# EAGLE design Motor_beaglebone_3ch (EAGLE 7.2.0)
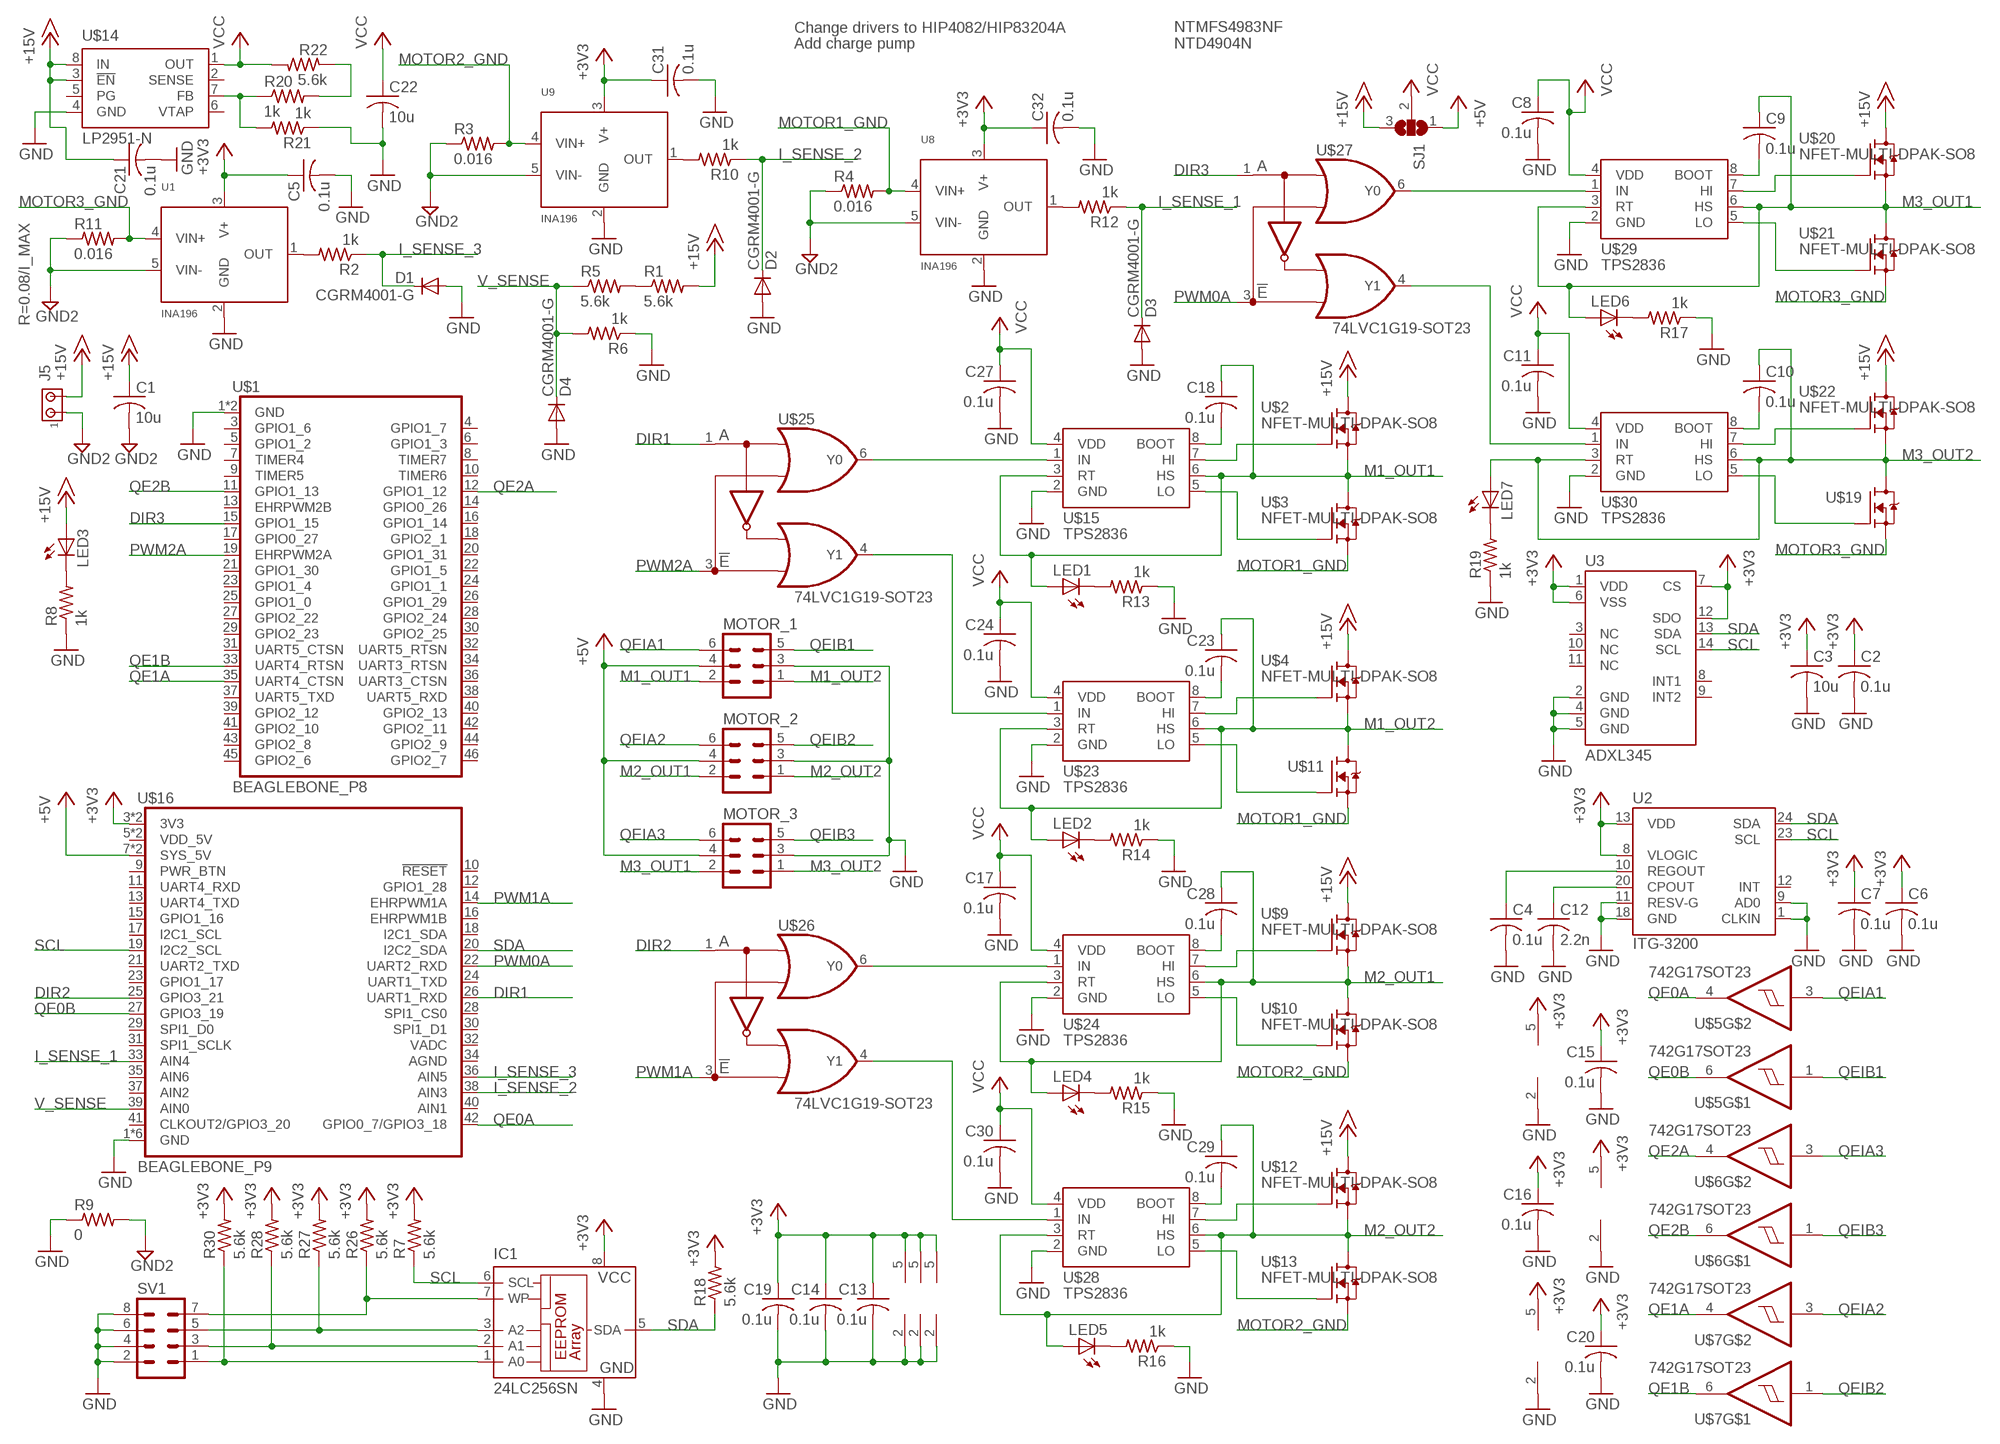
[diagram p0: schematic, sheet 1]

## Parts
C1  10u  C-USC1206  [C1206]
C2  0.1u  C-USC0603  [C0603]
C3  10u  C-USC1206  [C1206]
C4  0.1u  C-USC0603  [C0603]
C5  0.1u  C-USC0603  [C0603]
C6  0.1u  C-USC0603  [C0603]
C7  0.1u  C-USC0603  [C0603]
C8  0.1u  C-USC0603  [C0603]
C9  0.1u  C-USC0603  [C0603]
C10  0.1u  C-USC0603  [C0603]
C11  0.1u  C-USC0603  [C0603]
C12  2.2n  C-USC0603  [C0603]
C13  0.1u  C-USC0603  [C0603]
C14  0.1u  C-USC0603  [C0603]
C15  0.1u  C-USC0603  [C0603]
C16  0.1u  C-USC0603  [C0603]
C17  0.1u  C-USC0603  [C0603]
C18  0.1u  C-USC0603  [C0603]
C19  0.1u  C-USC0603  [C0603]
C20  0.1u  C-USC0603  [C0603]
C21  0.1u  C-USC0603  [C0603]
C22  10u  C-USC1206  [C1206]
C23  0.1u  C-USC0603  [C0603]
C24  0.1u  C-USC0603  [C0603]
C27  0.1u  C-USC0603  [C0603]
C28  0.1u  C-USC0603  [C0603]
C29  0.1u  C-USC0603  [C0603]
C30  0.1u  C-USC0603  [C0603]
C31  0.1u  C-USC0603  [C0603]
C32  0.1u  C-USC0603  [C0603]
D1  CGRM4001-G  [SOD-123_MINI-SMA]
D2  CGRM4001-G  [SOD-123_MINI-SMA]
D3  CGRM4001-G  [SOD-123_MINI-SMA]
D4  CGRM4001-G  [SOD-123_MINI-SMA]
IC1  24LC256SN  [SO-08]
J5  MTA02-156  [1X2MTA]
LED1  LED0603  [LED-0603]
LED2  LED0603  [LED-0603]
LED3  LED0603  [LED-0603]
LED4  LED0603  [LED-0603]
LED5  LED0603  [LED-0603]
LED6  LED0603  [LED-0603]
LED7  LED0603  [LED-0603]
MOTOR_1  MA03-2  [MA03-2]
MOTOR_2  MA03-2  [MA03-2]
MOTOR_3  MA03-2  [MA03-2]
R1  5.6k  R-US0603  [C0603]
R2  1k  R-US0603  [C0603]
R3  0.016  R-US1206  [C1206]
R4  0.016  R-US1206  [C1206]
R5  5.6k  R-US0603  [C0603]
R6  1k  R-US0603  [C0603]
R7  5.6k  R-US0603  [C0603]
R8  1k  R-US0603  [C0603]
R9  0  R-US0603  [C0603]
R10  1k  R-US0603  [C0603]
R11  0.016  R-US1206  [C1206]
R12  1k  R-US0603  [C0603]
R13  1k  R-US0603  [C0603]
R14  1k  R-US0603  [C0603]
R15  1k  R-US0603  [C0603]
R16  1k  R-US0603  [C0603]
R17  1k  R-US0603  [C0603]
R18  5.6k  R-US0603  [C0603]
R19  1k  R-US0603  [C0603]
R20  1k  R-US0603  [C0603]
R21  1k  R-US0603  [C0603]
R22  5.6k  R-US0603  [C0603]
R26  5.6k  R-US0603  [C0603]
R27  5.6k  R-US0603  [C0603]
R28  5.6k  R-US0603  [C0603]
R30  5.6k  R-US0603  [C0603]
SJ1  SJ2W  [SJ_2]
SV1  MA04-2  [MA04-2]
U1  INA196  [SOT23-5]
U2  ITG-3200  [QFN-24]
U3  ADXL345  [LGA14]
U8  INA196  [SOT23-5]
U9  INA196  [SOT23-5]
U$1  BEAGLEBONE_P8  [BEAGLEBONE_P8]
U$2  NFET-MULTI-DPAK-SO8  [DPAK-S08]
U$3  NFET-MULTI-DPAK-SO8  [DPAK-S08]
U$4  NFET-MULTI-DPAK-SO8  [DPAK-S08]
U$5  742G17SOT23  [SOT23-6]
U$6  742G17SOT23  [SOT23-6]
U$7  742G17SOT23  [SOT23-6]
U$9  NFET-MULTI-DPAK-SO8  [DPAK-S08]
U$10  NFET-MULTI-DPAK-SO8  [DPAK-S08]
U$11  NFET-MULTI-DPAK-SO8  [DPAK-S08]
U$12  NFET-MULTI-DPAK-SO8  [DPAK-S08]
U$13  NFET-MULTI-DPAK-SO8  [DPAK-S08]
U$14  LP2951-N  [VSSOP8]
U$15  TPS2836  [SO-08]
U$16  BEAGLEBONE_P9  [BEAGLEBONE_P9]
U$19  NFET-MULTI-DPAK-SO8  [DPAK-S08]
U$20  NFET-MULTI-DPAK-SO8  [DPAK-S08]
U$21  NFET-MULTI-DPAK-SO8  [DPAK-S08]
U$22  NFET-MULTI-DPAK-SO8  [DPAK-S08]
U$23  TPS2836  [SO-08]
U$24  TPS2836  [SO-08]
U$25  74LVC1G19-SOT23  [SOT23-6]
U$26  74LVC1G19-SOT23  [SOT23-6]
U$27  74LVC1G19-SOT23  [SOT23-6]
U$28  TPS2836  [SO-08]
U$29  TPS2836  [SO-08]
U$30  TPS2836  [SO-08]

## Nets
+3V3: C2.1 C3.1 C5.1 C6.1 C7.1 C13.1 C14.1 C15.1 C16.1 C19.1 C20.1 C31.1 C32.1 IC1.8(VCC) R7.2 R18.2 R26.2 R27.2 R28.2 R30.2 U1.3(V+) U2.8(VLOGIC) U2.13(VDD) U3.1(VDD) U3.6(VSS) U3.7(CS) U3.12(SDO) U8.3(V+) U9.3(V+) U$5.5(V+) U$6.5(V+) U$7.5(V+) U$16.3(3V3) U$16.4(3V3) U$25.5(V+) U$26.5(V+) U$27.5(V+)
+5V: MOTOR_1.4 MOTOR_2.4 MOTOR_3.4 SJ1.1 U$16.7(SYS_5V) U$16.8(SYS_5V)
+15V [pwr]: C1.1 C21.1 J5.2 LED3.A R1.2 SJ1.3 U$2.2(D) U$4.2(D) U$9.2(D) U$12.2(D) U$14.3(!EN) U$14.8(IN) U$20.2(D) U$22.2(D)
DIR1: U$16.26(UART1_RXD) U$25.1(A)
DIR2: U$16.25(GPIO3_21) U$26.1(A)
DIR3: U$1.15(GPIO1_15) U$27.1(A)
GND: C2.2 C3.2 C4.2 C5.2 C6.2 C7.2 C8.2 C11.2 C12.2 C13.2 C14.2 C15.2 C16.2 C17.2 C19.2 C20.2 C21.2 C22.2 C24.2 C27.2 C30.2 C31.2 C32.2 D1.A D2.A D3.A D4.A IC1.4(GND) MOTOR_1.3 MOTOR_2.3 MOTOR_3.3 R6.1 R8.1 R9.1 R13.1 R14.1 R15.1 R16.1 R17.1 R19.1 R21.1 SV1.2 SV1.4 SV1.6 SV1.8 U1.2(GND) U2.1(CLKIN) U2.9(AD0) U2.11(RESV-G) U2.18(GND) U3.2(GND) U3.4(GND) U3.5(GND) U8.2(GND) U9.2(GND) U$1.1(GND) U$1.2(GND) U$5.2(V-) U$6.2(V-) U$7.2(V-) U$14.4(GND) U$15.2(GND) U$16.1(GND) U$16.2(GND) U$16.43(GND) U$16.44(GND) U$16.45(GND) U$16.46(GND) U$23.2(GND) U$24.2(GND) U$25.2(V-) U$26.2(V-) U$27.2(V-) U$28.2(GND) U$29.2(GND) U$30.2(GND)
GND2 [pwr]: C1.2 J5.1 R3.1 R4.1 R9.2 R11.1 U1.5(VIN-) U8.5(VIN-) U9.5(VIN-)
I_SENSE_1: D3.C R12.1 U$16.33(AIN4)
I_SENSE_2: D2.C R10.1 U$16.38(AIN3)
I_SENSE_3: D1.C R2.1 U$16.36(AIN5)
M1_OUT1 [pwr]: C18.1 LED1.A MOTOR_1.2 U$2.3(S) U$2.4(S) U$2.5(S) U$2.6(S) U$3.2(D) U$15.3(RT) U$15.6(HS)
M1_OUT2 [pwr]: C23.1 LED2.A MOTOR_1.1 U$4.3(S) U$4.4(S) U$4.5(S) U$4.6(S) U$11.2(D) U$23.3(RT) U$23.6(HS)
M2_OUT1 [pwr]: C28.1 LED4.A MOTOR_2.2 U$9.3(S) U$9.4(S) U$9.5(S) U$9.6(S) U$10.2(D) U$24.3(RT) U$24.6(HS)
M2_OUT2 [pwr]: C29.1 LED5.A MOTOR_2.1 U$12.3(S) U$12.4(S) U$12.5(S) U$12.6(S) U$13.2(D) U$28.3(RT) U$28.6(HS)
M3_OUT1 [pwr]: C9.1 LED6.A MOTOR_3.2 U$20.3(S) U$20.4(S) U$20.5(S) U$20.6(S) U$21.2(D) U$29.3(RT) U$29.6(HS)
M3_OUT2 [pwr]: C10.1 LED7.A MOTOR_3.1 U$19.2(D) U$22.3(S) U$22.4(S) U$22.5(S) U$22.6(S) U$30.3(RT) U$30.6(HS)
MOTOR1_GND [pwr]: R4.2 U8.4(VIN+) U$3.3(S) U$3.4(S) U$3.5(S) U$3.6(S) U$11.3(S) U$11.4(S) U$11.5(S) U$11.6(S)
MOTOR2_GND [pwr]: R3.2 U9.4(VIN+) U$10.3(S) U$10.4(S) U$10.5(S) U$10.6(S) U$13.3(S) U$13.4(S) U$13.5(S) U$13.6(S)
MOTOR3_GND [pwr]: R11.2 U1.4(VIN+) U$19.3(S) U$19.4(S) U$19.5(S) U$19.6(S) U$21.3(S) U$21.4(S) U$21.5(S) U$21.6(S)
N$1: IC1.3(A2) R27.1 SV1.5
N$2: IC1.2(A1) R28.1 SV1.3
N$3: IC1.1(A0) R30.1 SV1.1
N$4: IC1.7(WP) R26.1 SV1.7
N$5: R1.1 R5.2
N$6: R2.2 U1.1(OUT)
N$8: R10.2 U9.1(OUT)
N$9: R12.2 U8.1(OUT)
N$10: U$2.1(G) U$2.7(G) U$15.7(HI)
N$11: U$3.1(G) U$3.7(G) U$15.5(LO)
N$13: LED1.C R13.2
N$14: LED2.C R14.2
N$15: LED3.C R8.2
N$16: C18.2 U$15.8(BOOT)
N$17: U$20.1(G) U$20.7(G) U$29.7(HI)
N$18: C28.2 U$24.8(BOOT)
N$19: U$21.1(G) U$21.7(G) U$29.5(LO)
N$20: C23.2 U$23.8(BOOT)
N$21: U$4.1(G) U$4.7(G) U$23.7(HI)
N$22: C9.2 U$29.8(BOOT)
N$23: U$11.1(G) U$11.7(G) U$23.5(LO)
N$24: C29.2 U$28.8(BOOT)
N$25: U$12.1(G) U$12.7(G) U$28.7(HI)
N$26: U$13.1(G) U$13.7(G) U$28.5(LO)
N$27: C10.2 U$30.8(BOOT)
N$28: U$9.1(G) U$9.7(G) U$24.7(HI)
N$29: U$10.1(G) U$10.7(G) U$24.5(LO)
N$30: U$22.1(G) U$22.7(G) U$30.7(HI)
N$31: U$19.1(G) U$19.7(G) U$30.5(LO)
N$32: C4.1 U2.10(REGOUT)
N$33: C12.1 U2.20(CPOUT)
N$34: LED4.C R15.2
N$35: LED5.C R16.2
N$36: LED6.C R17.2
N$37: LED7.C R19.2
N$38: R20.2 R22.1
N$39: R20.1 R21.2 U$14.7(FB)
N$41: U$23.1(IN) U$25.4(Y1)
N$42: U$15.1(IN) U$25.6(Y0)
N$43: U$27.6(Y0) U$29.1(IN)
N$44: U$27.4(Y1) U$30.1(IN)
N$45: U$24.1(IN) U$26.6(Y0)
N$46: U$26.4(Y1) U$28.1(IN)
PWM0A: U$16.22(UART2_RXD) U$27.3(!E)
PWM1A: U$16.14(EHRPWM1A) U$26.3(!E)
PWM2A: U$1.19(EHRPWM2A) U$25.3(!E)
QE0A: U$5.4(O) U$16.42(GPIO0_7/GPIO3_18)
QE0B: U$5.6(O) U$16.27(GPIO3_19)
QE1A: U$1.35(UART4_CTSN) U$7.4(O)
QE1B: U$1.33(UART4_RTSN) U$7.6(O)
QE2A: U$1.12(GPIO1_12) U$6.4(O)
QE2B: U$1.11(GPIO1_13) U$6.6(O)
QEIA1: MOTOR_1.6 U$5.3(I)
QEIA2: MOTOR_2.6 U$7.3(I)
QEIA3: MOTOR_3.6 U$6.3(I)
QEIB1: MOTOR_1.5 U$5.1(I)
QEIB2: MOTOR_2.5 U$7.1(I)
QEIB3: MOTOR_3.5 U$6.1(I)
SCL: IC1.6(SCL) R7.1 U2.23(SCL) U3.14(SCL) U$16.19(I2C2_SCL)
SDA: IC1.5(SDA) R18.1 U2.24(SDA) U3.13(SDA) U$16.20(I2C2_SDA)
V_SENSE: D4.C R5.1 R6.2 U$16.39(AIN0)
VCC: C8.1 C11.1 C17.1 C22.1 C24.1 C27.1 C30.1 R22.2 SJ1.2 U$14.1(OUT) U$15.4(VDD) U$23.4(VDD) U$24.4(VDD) U$28.4(VDD) U$29.4(VDD) U$30.4(VDD)
Unconnected: U2.12(INT) U3.3(NC) U3.8(INT1) U3.9(INT2) U3.10(NC) U3.11(NC) U$1.3(GPIO1_6) U$1.4(GPIO1_7) U$1.5(GPIO1_2) U$1.6(GPIO1_3) U$1.7(TIMER4) U$1.8(TIMER7) U$1.9(TIMER5) U$1.10(TIMER6) U$1.13(EHRPWM2B) U$1.14(GPIO0_26) U$1.16(GPIO1_14) U$1.17(GPIO0_27) U$1.18(GPIO2_1) U$1.20(GPIO1_31) U$1.21(GPIO1_30) U$1.22(GPIO1_5) U$1.23(GPIO1_4) U$1.24(GPIO1_1) U$1.25(GPIO1_0) U$1.26(GPIO1_29) U$1.27(GPIO2_22) U$1.28(GPIO2_24) U$1.29(GPIO2_23) U$1.30(GPIO2_25) U$1.31(UART5_CTSN) U$1.32(UART5_RTSN) U$1.34(UART3_RTSN) U$1.36(UART3_CTSN) U$1.37(UART5_TXD) U$1.38(UART5_RXD) U$1.39(GPIO2_12) U$1.40(GPIO2_13) U$1.41(GPIO2_10) U$1.42(GPIO2_11) U$1.43(GPIO2_8) U$1.44(GPIO2_9) U$1.45(GPIO2_6) U$1.46(GPIO2_7) U$14.2(SENSE) U$14.5(PG) U$14.6(VTAP) U$16.5(VDD_5V) U$16.6(VDD_5V) U$16.9(PWR_BTN) U$16.10(!RESET) U$16.11(UART4_RXD) U$16.12(GPIO1_28) U$16.13(UART4_TXD) U$16.15(GPIO1_16) U$16.16(EHRPWM1B) U$16.17(I2C1_SCL) U$16.18(I2C1_SDA) U$16.21(UART2_TXD) U$16.23(GPIO1_17) U$16.24(UART1_TXD) U$16.28(SPI1_CS0) U$16.29(SPI1_D0) U$16.30(SPI1_D1) U$16.31(SPI1_SCLK) U$16.32(VADC) U$16.34(AGND) U$16.35(AIN6) U$16.37(AIN2) U$16.40(AIN1) U$16.41(CLKOUT2/GPIO3_20)

## Notes on the sheet
- Change drivers to HIP4082/HIP83204A
- Add charge pump
- NTMFS4983NF
  NTD4904N
- R=0.08/I_MAX

## Library data of the parts
C1-C24 C27-C32 = GT-IEEE:C-US: CAPACITOR, American symbol
D1-D4 = diode:CGRM400*-G: Molded plasitc,JEDEC SOD-123/Mini SMA Source: Comchip CGRM4001-G.pdf
IC1 = microchip:24*: Serial EEPROM I2C; MF: MICROCHIP; MPN: 24LC256-I/SN; OC_FARNELL: 9757996; OC_NEWARK: 27C9144
J5 = con-amp:MTA02-156: AMP connector
LED1-LED7 = SparkFun-LED:LED: LEDs Standard schematic elements and footprints for 5mm, 3mm, 1206, and 0603 sized LEDs. 5mm - Spark Fun Electronics SKU : COM-00529 (and others)
MOTOR_1-MOTOR_3 = con-lstb:MA03-2: PIN HEADER; OC_FARNELL: unknown; OC_NEWARK: unknown
R1-R22 R26-R28 R30 = GT-IEEE:R-US
SJ1 = jumper:SJ2W: SMD solder JUMPER
SV1 = con-lstb:MA04-2: PIN HEADER; OC_FARNELL: unknown; OC_NEWARK: unknown
U1 U8 U9 = DSS:INA196: TI INA196 Current Sensor http://www.ti.com/product/ina196
U2 = SparkFun-Sensors:ITG-3200: ITG-3200 3-axis gyro, digital output, qfn24 package
U3 = SparkFun-Sensors:ADXL345: 3-axis SPI/I2C 2/4/8/16g accelerometer
U$1 = beaglebone:BEAGLEBONE_P8
U$2-U$4 U$9 U$10 U$12 U$13 U$20-U$22 = GT-IEEE:NFET-MULTI
U$5-U$7 = GT-IEEE:74*2G17
U$11 U$19 = HBridge:NFET-MULTI
U$14 = GT-IEEE:LP2951-N
U$15 U$23 U$24 U$28-U$30 = GT-IEEE:TPS2836
U$16 = beaglebone:BEAGLEBONE_P9
U$25-U$27 = GT-IEEE:74LVC1G19

## Board
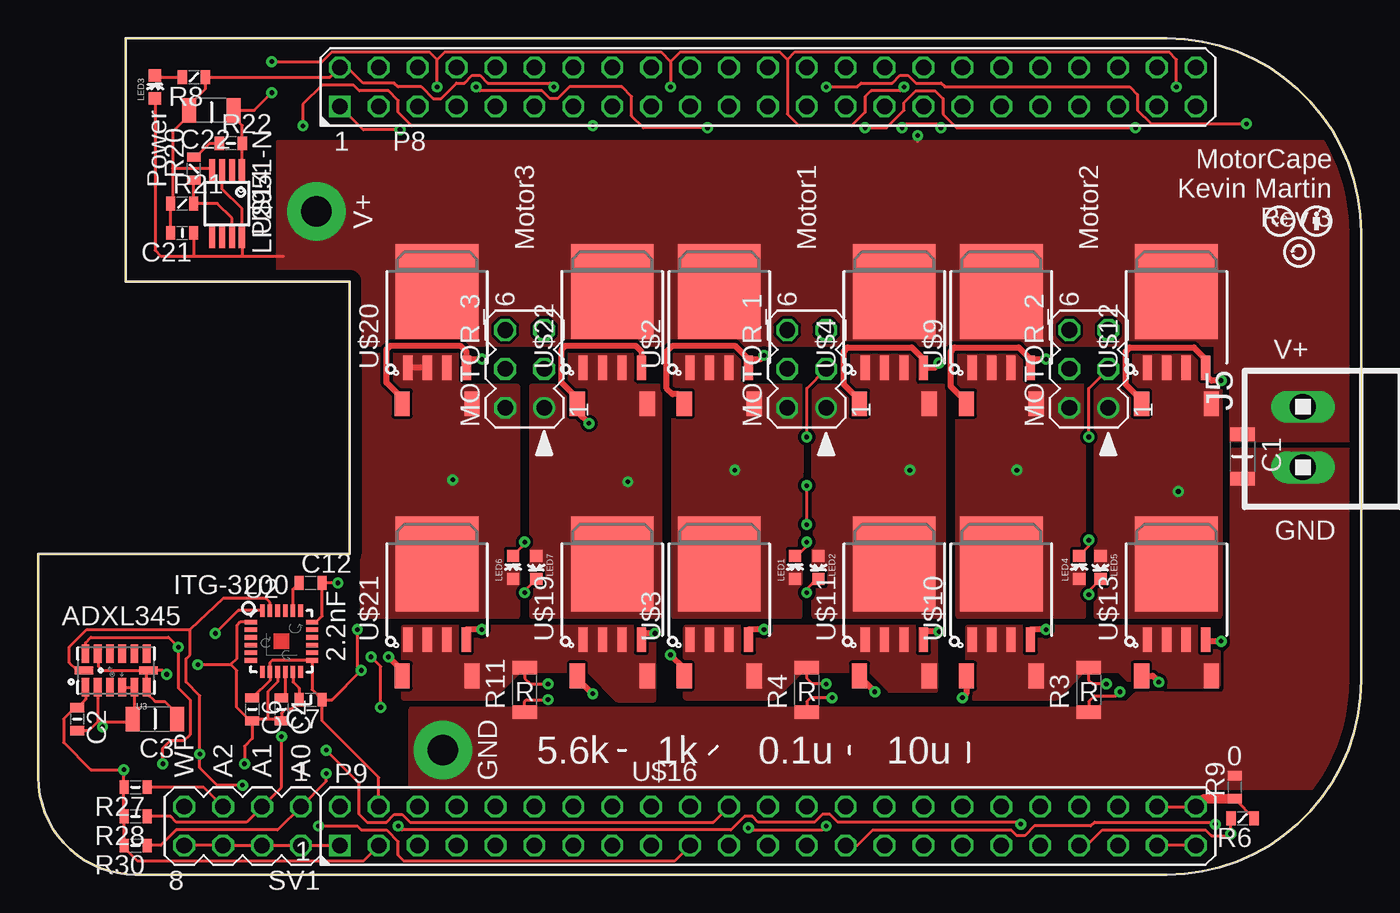
[diagram p1: board, top side]
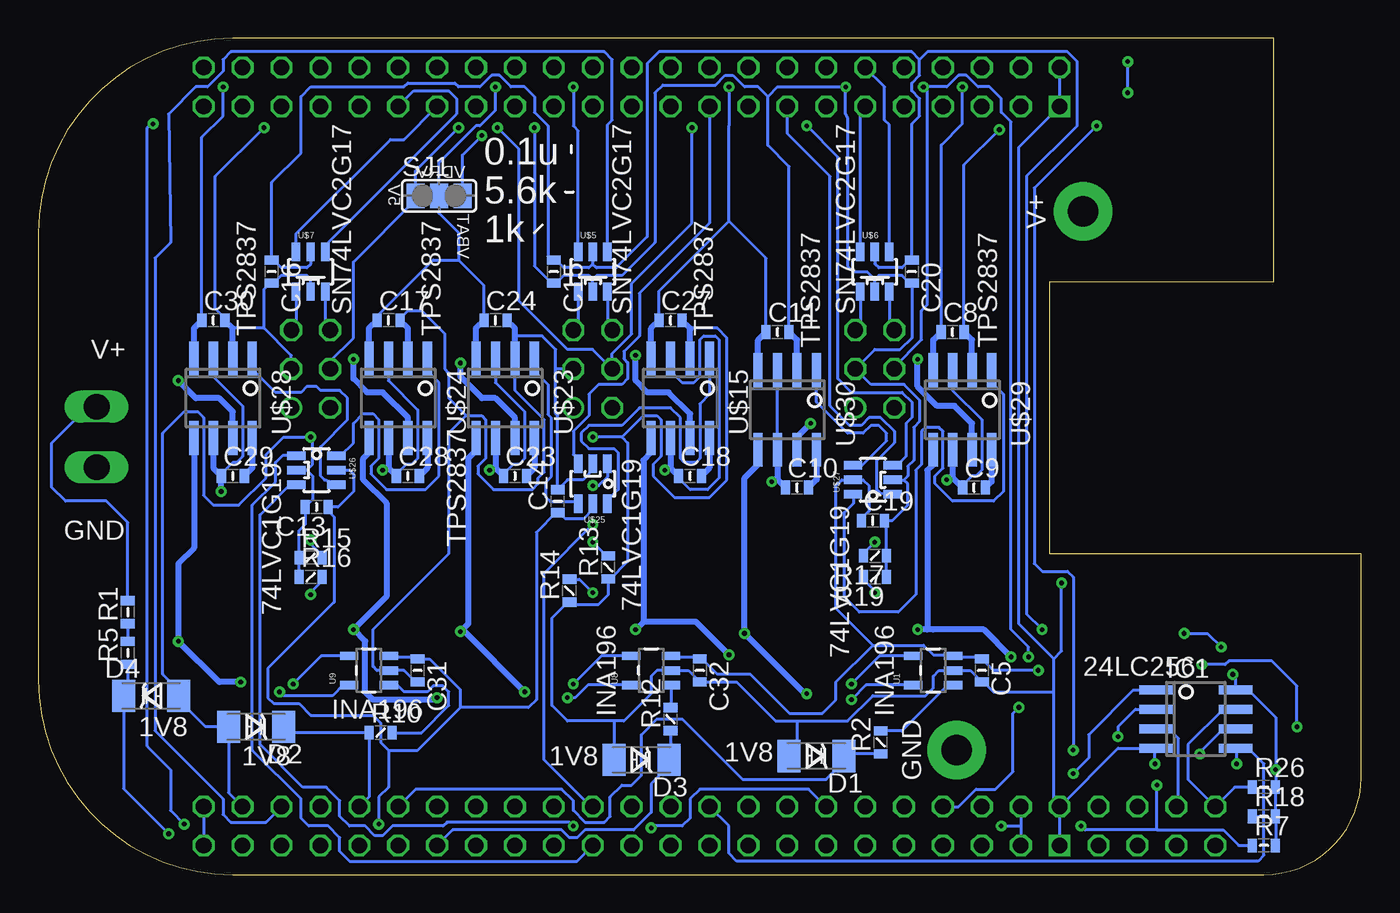
[diagram p2: board, bottom side, seen from below]

Size 86.36 x 54.61 mm. Coordinates in mm from the lower left corner, seen from the top.
Outline: 0,20.95 20.32,20.95 20.32,38.73 5.71,38.73 5.71,54.61 73.66,54.61 arc-90 86.36,41.91 86.36,12.7 arc-90 73.66,0 6.35,0 arc-90 0,6.35 0,20.95
Copper layers (1*16): Top 0.035mm / dielectric 1.5mm / Bottom 0.035mm
Design rules "default *": minimum track width 8mil, minimum drill 12mil, track to track 8mil, track to pad 8mil, pad to pad 8mil, via to via 8mil, smd to smd 8mil, copper to edge 30mil, drill to drill 8mil, minimum pad ring 8mil, minimum via ring 8mil, stop-mask expansion 2mil, vias tented up to drill 0mil, thermal gap 8mil

### Footprints (pad centres in the part's own frame; a part is rotated, then mirrored left to right if it is on the bottom)
C1206 = smd 0.9 x 1.6: 1 -1.45,0; 2 1.45,0
C0603 = smd 0.6 x 0.9: 1 -0.75,0; 2 0.75,0
SOD-123_MINI-SMA = smd 1.5 x 2.1: A 1.8,0; C -1.8,0
SO-08 = smd 0.6 x 2.2: 1 -1.905,-2.6; 2 -0.635,-2.6; 3 0.635,-2.6; 4 1.905,-2.6; 5 1.905,2.6; 6 0.635,2.6; 7 -0.635,2.6; 8 -1.905,2.6
1X2MTA = drill 1.676 long: 1 1.981,0; 2 -1.981,0
LED-0603 = smd 0.8 x 0.8: A 0,-0.75; C 0,0.75
MA03-2 = drill 1.016: 1 -2.54,-1.27 | drill 1.016 octagon: 2 -2.54,1.27; 3 0,-1.27; 4 0,1.27; 5 2.54,-1.27; 6 2.54,1.27
SJ_2 = smd 1.168 x 1.6: 1 -1.524,0; 2 0,0; 3 1.524,0
MA04-2 = drill 1.016 octagon: 1 -3.81,-1.27; 2 -3.81,1.27; 3 -1.27,-1.27; 4 -1.27,1.27; 5 1.27,-1.27; 6 1.27,1.27; 7 3.81,-1.27; 8 3.81,1.27
SOT23-5 = smd 0.55 x 1.2: 1 -0.95,-1.3; 2 0,-1.3; 3 0.95,-1.3; 4 0.95,1.3; 5 -0.95,1.3
QFN-24 = smd 0.8 x 0.3: 1 -2,1.25; 2 -2,0.75; 3 -2,0.25; 4 -2,-0.25; 5 -2,-0.75; 6 -2,-1.25; 13 2,-1.25; 14 2,-0.75; 15 2,-0.25; 16 2,0.25; 17 2,0.75; 18 2,1.25 | smd 0.3 x 0.8: 7 -1.25,-2; 8 -0.75,-2; 9 -0.25,-2; 10 0.25,-2; 11 0.75,-2; 12 1.25,-2; 19 1.25,2; 20 0.75,2; 21 0.25,2; 22 -0.25,2; 23 -0.75,2; 24 -1.25,2
LGA14 = smd 0.5 x 1.2: 1 2,1.1; 2 1.2,1.1; 3 0.4,1.1; 4 -0.4,1.1; 5 -1.2,1.1; 6 -2,1.1; 8 -2,-1.1; 9 -1.2,-1.1; 10 -0.4,-1.1; 11 0.4,-1.1; 12 1.2,-1.1; 13 2,-1.1 | smd 1.2 x 0.5: 7 -2.1,0; 14 2.1,0
BEAGLEBONE_P8 = drill 1.016 square: 1 -27.94,22.86 | drill 1.016 octagon: 2 -27.94,25.4; 3 -25.4,22.86; 4 -25.4,25.4; 5 -22.86,22.86; 6 -22.86,25.4; 7 -20.32,22.86; 8 -20.32,25.4; 9 -17.78,22.86; 10 -17.78,25.4; 11 -15.24,22.86; 12 -15.24,25.4; 13 -12.7,22.86; 14 -12.7,25.4; 15 -10.16,22.86; 16 -10.16,25.4; 17 -7.62,22.86; 18 -7.62,25.4; 19 -5.08,22.86; 20 -5.08,25.4; 21 -2.54,22.86; 22 -2.54,25.4; 23 0,22.86; 24 0,25.4; 25 2.54,22.86; 26 2.54,25.4; 27 5.08,22.86; 28 5.08,25.4; 29 7.62,22.86; 30 7.62,25.4; 31 10.16,22.86; 32 10.16,25.4; 33 12.7,22.86; 34 12.7,25.4; 35 15.24,22.86; 36 15.24,25.4; 37 17.78,22.86; 38 17.78,25.4; 39 20.32,22.86; 40 20.32,25.4; 41 22.86,22.86; 42 22.86,25.4; 43 25.4,22.86; 44 25.4,25.4; 45 27.94,22.86; 46 27.94,25.4
DPAK-S08 = smd 1 x 1.6: 1 -2.28,-4.8; 3 2.28,-4.8 | smd 5.4 x 6.2: 2 0,2.5 | smd 0.6 x 1.6: 4 -1.905,-2.45; 5 -0.635,-2.45; 6 0.635,-2.45; 7 1.905,-2.45
SOT23-6 = smd 0.55 x 1.2: 1 -0.95,-1.3; 2 0,-1.3; 3 0.95,-1.3; 4 0.95,1.3; 5 0,1.3; 6 -0.95,1.3
VSSOP8 = smd 0.4 x 1.6: 1 -0.975,-2.1; 2 -0.325,-2.1; 3 0.325,-2.1; 4 0.975,-2.1; 5 0.975,2.1; 6 0.325,2.1; 7 -0.325,2.1; 8 -0.975,2.1
BEAGLEBONE_P9 = drill 1.016 square: 1 -27.94,-25.4 | drill 1.016 octagon: 2 -27.94,-22.86; 3 -25.4,-25.4; 4 -25.4,-22.86; 5 -22.86,-25.4; 6 -22.86,-22.86; 7 -20.32,-25.4; 8 -20.32,-22.86; 9 -17.78,-25.4; 10 -17.78,-22.86; 11 -15.24,-25.4; 12 -15.24,-22.86; 13 -12.7,-25.4; 14 -12.7,-22.86; 15 -10.16,-25.4; 16 -10.16,-22.86; 17 -7.62,-25.4; 18 -7.62,-22.86; 19 -5.08,-25.4; 20 -5.08,-22.86; 21 -2.54,-25.4; 22 -2.54,-22.86; 23 0,-25.4; 24 0,-22.86; 25 2.54,-25.4; 26 2.54,-22.86; 27 5.08,-25.4; 28 5.08,-22.86; 29 7.62,-25.4; 30 7.62,-22.86; 31 10.16,-25.4; 32 10.16,-22.86; 33 12.7,-25.4; 34 12.7,-22.86; 35 15.24,-25.4; 36 15.24,-22.86; 37 17.78,-25.4; 38 17.78,-22.86; 39 20.32,-25.4; 40 20.32,-22.86; 41 22.86,-25.4; 42 22.86,-22.86; 43 25.4,-25.4; 44 25.4,-22.86; 45 27.94,-25.4; 46 27.94,-22.86

### Placement (x,y rotation side)
C1  78.61,27.3 270 top
C2  2.54,10.16 270 top
C3  7.62,10.16 180 top
C4  15.88,10.79 270 top
C5  24.77,13.34 270 bottom
C6  13.97,10.79 270 top
C7  17.78,11.43 180 top
C8  26.67,35.43 0 bottom
C9  25.27,25.27 0 bottom
C10  36.83,25.27 0 bottom
C11  38.1,35.43 0 bottom
C12  17.78,19.05 0 top
C13  68.2,24 180 bottom
C14  52.45,24.38 90 bottom
C15  52.7,39.37 270 bottom
C16  71.12,39.37 270 bottom
C17  63.5,36.2 0 bottom
C18  43.81,26.04 0 bottom
C19  31.88,23.11 0 bottom
C20  29.34,39.37 270 bottom
C21  9.4,41.91 180 top
C22  11.3,49.91 180 top
C23  55.24,26.04 0 bottom
C24  56.52,36.2 0 bottom
C27  45.09,36.2 0 bottom
C28  62.23,26.04 0 bottom
C29  73.66,26.04 0 bottom
C30  74.93,36.2 0 bottom
C31  61.59,13.34 270 bottom
C32  43.18,13.34 270 bottom
D1  35.56,7.75 180 bottom
D2  72.14,9.65 180 bottom
D3  46.99,7.49 180 bottom
D4  78.99,11.68 0 bottom
IC1  10.79,10.16 270 bottom
J5  82.55,28.57 270 top
LED1  49.4,20.07 0 top
LED2  50.93,20.07 180 top
LED3  7.62,51.44 0 top
LED4  67.94,20.07 0 top
LED5  69.34,20.07 180 top
LED6  30.99,20.07 0 top
LED7  32.51,20.07 180 top
MOTOR_1  50.16,33.02 90 top
MOTOR_2  68.58,33.02 90 top
MOTOR_3  31.75,33.02 90 top
R1  80.52,17.14 90 bottom
R2  31.37,8.64 90 bottom
R3  68.58,12.06 90 top
R4  50.16,12.06 90 top
R5  80.52,14.48 90 bottom
R6  78.61,3.68 180 top
R7  6.35,1.91 0 bottom
R8  10.16,52.07 180 top
R9  78.11,5.71 90 top
R10  64.01,9.27 0 bottom
R11  31.75,12.06 90 top
R12  45.09,10.16 90 bottom
R13  49.15,20.07 90 bottom
R14  51.69,18.54 90 bottom
R15  68.58,20.7 0 bottom
R16  68.58,19.43 0 bottom
R17  31.75,20.83 180 bottom
R18  6.35,3.81 0 bottom
R19  31.75,19.43 180 bottom
R20  10.16,46.1 90 top
R21  9.4,43.81 0 top
R22  12.57,47.75 0 top
R26  6.35,5.71 0 bottom
R27  6.35,5.71 180 top
R28  6.35,3.81 180 top
R30  6.35,1.91 180 top
SJ1  60.2,44.32 0 bottom
SV1  13.34,3.17 180 top
U1  27.94,13.34 90 bottom
U2  15.88,15.24 0 top
U3  5.08,13.34 180 top
U8  46.35,13.34 90 bottom
U9  64.77,13.34 90 bottom
U$1  47.62,27.3 0 top
U$2  44.45,35.56 0 top
U$3  44.45,17.78 0 top
U$4  55.88,35.56 0 top
U$5  50.16,39.37 0 bottom
U$6  31.75,39.37 0 bottom
U$7  68.58,39.37 0 bottom
U$9  62.87,35.56 0 top
U$10  62.87,17.78 0 top
U$11  55.88,17.78 0 top
U$12  74.3,35.56 0 top
U$13  74.3,17.78 0 top
U$14  12.32,43.81 180 top
U$15  44.45,31.11 180 bottom
U$16  47.62,27.3 0 top
U$19  37.47,17.78 0 top
U$20  26.04,35.56 0 top
U$21  26.04,17.78 0 top
U$22  37.47,35.56 0 top
U$23  55.88,31.11 180 bottom
U$24  62.87,31.11 180 bottom
U$25  50.16,25.53 180 bottom
U$26  68.2,26.42 270 bottom
U$27  31.88,25.78 90 bottom
U$28  74.3,31.11 180 bottom
U$29  26.04,30.35 180 bottom
U$30  37.47,30.35 180 bottom

### Tracks (layer width: path | path; a pad name or v marks a point on that pad's centre or on a via)
+3V3  (via drill 0.3)
  Top 0.203: 5.59,3.81 5.59,1.91 R30.2 5.6,1.77 6.48,0.89 21.21,0.89 U$16.3 | 5.59,3.81 5.59,5.71 R27.2 5.59,5.73 v5.59,6.86 3.43,6.86 1.65,8.64 1.65,10.16 2.4,10.91 C2.1 3.08,11.45 U3.1 | 5.59,3.81 R28.2 | C7.1 17.88,12.09 U2.13 15.26,13.99 15.12,13.86 U2.8 15.12,12.7 C6.1 | C7.1 19.18,11.43 v21.08,13.34 20.83,13.59 v20.83,16 | v8.38,13.08 8.13,13.34 U3.7 | U3.7 7.08,13.23 U3.6 7.08,11.84 7.62,11.3 8.26,11.3 9.07,10.49 C3.1 | U$16.4 22.23,6.35 18.54,10.03 18.54,11.42 C7.1 | U3.7 4.19,13.34 3.94,13.59 3.94,14.38 U3.12 | v64.14,3.3 64.01,3.43 52.2,3.43 51.69,3.94 51.18,3.94 50.67,3.43 46.99,3.43 46.61,3.81 46.1,3.81 45.21,2.92 23.75,2.92 v23.5,3.17
  Bottom 0.203: 5.59,3.81 5.59,1.91 R30.2 | 5.59,3.81 5.59,5.71 R27.2 5.59,5.73 v5.59,6.86 5.59,10.29 7.37,12.06 IC1.8 8.2,12.89 v8.38,13.08 | 5.59,3.81 R28.2 | v20.83,16 21.84,17.02 21.84,45.59 18.54,48.9 18.54,53.09 19.18,53.72 28.32,53.72 28.83,53.21 | U9.3 63.05,14.29 62.99,14.22 61.73,14.22 C31.1 60.82,14.09 58.8,12.06 58.8,10.92 | U8.3 44.77,14.29 44.7,14.22 43.32,14.22 C32.1 43.04,14.09 42.04,13.08 39.88,13.08 37.34,10.54 35.18,10.54 34.29,11.43 34.29,12.57 31.88,14.99 | 31.88,14.99 28.57,14.99 27.94,14.35 26.67,14.35 U1.3 26.54,14.22 24.9,14.22 C5.1 24.02,13.34 v21.08,13.34 | U$26.5 66.04,26.42 65.79,26.16 65.79,25.02 66.8,24 C13.1 67.45,23.76 67.06,23.37 67.06,17.78 67.07,17.77 71.37,13.46 71.37,11.56 70.99,11.18 69.34,11.18 68.58,10.41 64.52,10.41 64.01,9.91 64.01,8.64 63.5,8.13 | 31.88,14.99 34.29,17.4 34.29,25.4 33.91,25.78 U$27.5 32.51,25.78 32.13,25.4 32.13,23.74 32.63,23.24 C19.1 | 58.8,10.92 54.36,10.92 53.85,11.43 53.85,22.35 52.57,23.63 C14.1 52.34,23.63 51.94,23.24 50.77,23.24 50.16,23.85 U$25.5 | U$7.5 68.58,39.88 68.83,39.62 70.5,39.62 70.99,40.12 C16.1 71.12,45.21 69.22,47.12 69.22,50.8 68.58,51.44 62.48,51.44 62.23,51.69 59.18,51.69 58.93,51.44 57.53,51.44 56.77,52.2 56.26,52.2 55.5,51.44 54.61,51.44 53.98,50.8 53.98,49.78 53.09,48.9 53.09,40.39 52.82,40.12 C15.1 | U$5.5 50.16,39.88 | 50.16,39.88 50.42,39.62 52.07,39.62 52.57,40.12 C15.1 | U$6.5 31.75,39.88 31.5,39.62 29.97,39.62 29.48,40.12 C20.1 29.32,40.13 29.32,49.03 28.83,49.53 28.83,50.67 29.34,51.18 29.34,51.69 28.83,52.2 28.83,53.21 | 50.16,39.88 49.91,39.62 48.64,39.62 46.61,41.66 46.61,52.96 45.85,53.72 29.34,53.72 28.83,53.21
  Bottom 0.203: U$16.4 22.23,3.17 | 22.23,3.17 U$16.3 | 52.72,40.13 C15.1 | 63.5,8.13 61.59,8.13 58.8,10.92 | 63.5,8.13 63.5,5.71 64.14,5.08 v64.14,3.3 | v23.5,3.17 22.23,3.17
+5V  (via drill 0.3)
  Top 0.203: v43.69,48.77 39.5,48.77 38.73,49.53 38.73,50.8 38.1,51.44 34.67,51.44 33.91,50.67 33.4,50.67 32.89,51.18 28.83,51.18 v28.57,51.44 | v22.35,10.92 22.35,13.59 v21.72,14.22 | v56.39,48.77 56.64,49.02 58.67,49.02 v58.93,48.77
  Bottom 0.203: MOTOR_2.4 67.31,33.53 65.79,35.05 65.79,40.01 61.72,44.07 SJ1.1 61.72,45.97 v58.93,48.77 | MOTOR_3.4 30.48,33.15 28.7,34.92 28.7,36.83 28.32,37.21 28.32,51.18 v28.57,51.44 27.05,51.44 26.29,52.2 25.78,52.2 25.02,51.44 24.26,51.44 23.5,50.67 23.5,49.78 22.86,49.15 22.86,16 21.72,14.86 v21.72,14.22 | U$16.8 26.29,4.45 25.15,5.59 23.88,5.59 22.73,6.73 22.73,10.54 v22.35,10.92 | v43.69,48.77 43.69,42.55 47.62,38.61 47.62,35.31 48.9,34.04 MOTOR_1.4 50.16,34.29 51.82,34.29 54.99,37.47 54.99,47.37 v56.39,48.77
+15V  (via drill 0.3, 2 pad 3.81)
  Top 0.203: LED3.A 7.62,40.77 8,40.39 10.16,40.39 | 10.16,40.39 13.34,40.39 | 13.34,40.39 16,40.39 | 13.34,40.39 13.29,40.43 U$14.8 13.29,43.48 11.99,44.77 U$14.3 | C21.1 10.15,40.4 10.16,40.39 | v57.4,48.26 57.4,47.88
  Bottom 0.203: J5.2 83.11,30.56 85.47,28.19 85.47,25.27 84.58,24.38 81.92,24.38 80.52,22.99 R1.2 | SJ1.3 58.67,46.99 v57.4,48.26
  other vias: 18.16,43.31
  pour Top (isolate 0.203, no thermals): 86.36,28.32 77.85,28.32 77.85,32.13 76.83,32.13 76.83,34.54 15.62,34.54 15.62,47.88 86.36,47.88
DIR1  (via drill 0.3)
  Top 0.203: v50.16,22.86 v50.16,25.4
  Bottom 0.203: U$16.26 50.29,4.45 53.34,7.49 53.34,19.68 v50.16,22.86 | U$25.1 49.22,25.97 49.78,25.4 v50.16,25.4
DIR2
  Bottom 0.203: U$16.25 51.18,0.89 66.04,0.89 66.67,1.52 66.67,2.41 67.44,3.17 68.71,3.17 69.22,3.68 69.22,4.95 72.39,8.13 72.39,24.13 70.87,25.65 70.87,26.92 70.42,27.37 U$26.1
DIR3
  Bottom 0.203: U$27.1 31.35,24.88 31.62,25.15 31.62,27.05 30.48,28.19 30.48,28.96 31.37,29.84 32.13,29.84 32.64,29.34 33.4,29.34 34.67,30.61 34.67,45.59 37.47,48.39 U$1.15
GND  (via drill 0.3)
  Top 0.203: SV1.8 SV1.6 SV1.4 SV1.2 U$16.1 | U2.18 18.14,16.49 18.54,16.89 18.54,19.04 C12.2 v19.56,19.05 | U2.9 15.62,12.58 14.99,11.94 14.99,10.16 | 14.99,10.16 15.76,10.16 C4.2 15.88,10.54 16.13,10.79 16.51,10.79 17.03,11.31 C7.2 17.02,11.44 17.02,12.19 16.62,12.59 U2.11 | C6.2 14.09,10.16 14.99,10.16 | U3.2 3.88,9.98 | 3.88,9.98 3.3,9.4 2.55,9.4 C2.2 | 3.88,9.98 4.19,9.98 | 4.19,9.98 5.72,9.98 C3.2 6.28,10.27 U3.5 U3.4 | U2.1 13.19,16.49 12.95,16.26 12.95,14.1 12.57,13.72 | C6.2 13.83,10.04 12.95,10.92 12.95,13.34 12.57,13.72 | C6.2 13.97,8.89 13.46,8.38 v13.46,7.24 | 4.19,9.98 v4.19,9.65 | R9.1 78.11,4.94 R6.1 | v68.58,28.57 68.58,31.75 MOTOR_2.3 | v50.16,28.57 50.16,31.75 MOTOR_1.3 | U$16.44 U$16.46 | U$16.45 U$16.43 | v10.41,13.72 12.57,13.72 | v33.66,51.44 33.4,51.69 29.34,51.69 28.83,52.2 28.32,52.2 27.81,51.69 27.3,51.69 26.29,50.67 25.78,50.67 25.02,51.44 23.5,51.44 23.24,51.69 21.21,51.69 20.19,52.7 U$1.2 19.05,52.07 R8.1 10.91,51.3 9.85,50.24 C22.2 9.85,49.6 8.76,48.51 8.76,46.1 | v53.98,48.77 55.37,48.77 56.52,49.91 56.52,50.42 57.28,51.18 58.55,51.18 59.05,50.67 59.05,49.66 59.94,48.77 v71.63,48.77 | v23.62,48.64 21.21,48.64 U$1.1 | C21.2 R21.1 8.76,43.93 8.76,46.1 | U$14.4 11.34,46.06 11.3,46.1 8.76,46.1
  Top 0.61: U$16.46 76.08,4.96 R9.1
  Bottom 0.203: 13.46,8.26 15.88,8.26 U$16.2 | U$16.2 20.07,4.83 20.07,11.94 | 20.07,11.94 20.07,14.1 | v13.46,7.24 13.46,8.26 | 13.46,8.26 IC1.4 | v4.19,9.65 4.19,12.32 5.84,13.97 8.64,13.97 8.89,13.72 v10.41,13.72 | 20.07,14.1 19.56,14.61 v19.56,19.05 | C31.2 61.73,12.59 62.48,13.34 U9.2 64.26,13.34 64.52,13.59 64.52,16 59.56,20.95 59.56,28.83 58.42,29.97 | 36.83,10.03 38.23,10.03 40.78,12.59 C32.2 43.93,13.34 U8.2 45.97,13.34 46.35,12.95 46.35,11.81 48.13,10.03 48.77,10.03 | 36.83,10.03 33.53,10.03 31.88,11.68 28.45,11.68 27.94,12.19 27.94,12.95 27.56,13.34 U1.2 25.52,13.34 C5.2 24.65,12.59 24,11.94 20.07,11.94 | U$25.2 50.16,26.42 50.8,25.78 51.82,25.78 52.21,25.39 C14.2 52.45,30 52.58,30.12 52.58,33.02 | U$27.2 29.84,25.78 | 48.77,10.03 51.82,10.03 52.83,11.05 52.83,16.76 51.8,17.79 R14.1 51.57,17.79 51.44,17.65 49.78,17.65 49.15,18.29 R13.1 49.01,19.32 47.88,20.45 47.88,28.19 48.26,28.57 | U$26.2 68.83,26.42 | 68.83,26.42 68.45,26.04 68.45,24.5 C13.2 68.95,22.87 69.33,22.49 R15.1 R16.1 | 68.83,26.42 68.45,26.8 68.45,28.45 v68.58,28.57 70.36,28.57 71.5,27.43 71.5,25.91 73.28,24.13 74.93,24.13 75.56,24.77 75.56,29.84 75.95,30.23 76.83,30.23 78.23,28.83 78.23,13.08 77.19,12.04 D4.A 77.19,11.41 75.44,9.65 D2.A 73.94,5.36 U$16.44 | 29.84,25.78 29.59,25.53 29.59,24.13 30.61,23.11 C19.2 31,22.99 R17.1 R19.1 | MOTOR_2.3 69.85,33.91 71.63,35.69 | 71.63,35.69 73.65,35.69 73.66,35.67 | MOTOR_1.3 52.58,33.02 | 52.58,33.02 52.58,34.29 53.47,35.18 55.24,35.18 | 48.26,28.57 46.86,29.97 45.97,29.97 45.72,29.72 45.72,27.3 46.23,26.8 46.23,26.04 44.83,24.64 42.55,24.64 41.4,25.78 41.4,35.05 42.04,35.69 43.69,35.69 43.81,35.56
  Bottom 0.203: 48.26,28.57 v50.16,28.57 | 62.75,36.33 C17.2 62.75,36.31 62.23,36.83 61.34,36.83 59.82,35.31 59.82,33.02 59.56,32.77 59.56,31.11 58.42,29.97 | C30.2 74.18,36.33 74.8,36.96 74.8,45.59 v71.63,48.77 | C11.2 37.35,46.24 38.73,47.62 38.73,50.8 | 20.07,14.1 22.35,16.38 22.35,47.5 U$1.1 U$1.2 | 58.42,29.97 57.4,29.97 57.15,29.72 57.15,27.18 57.66,26.67 57.66,26.16 56.64,25.15 54.1,25.15 53.72,25.53 53.72,25.91 53.34,26.29 53.34,29.72 55.24,31.62 U$23.2 | 29.84,25.78 29.59,26.04 29.59,26.67 29.21,27.05 29.21,29.21 28.83,29.59 28.83,30.99 29.84,32 32,32 MOTOR_3.3 31.75,34.29 30.1,34.29 29.34,35.05 C20.2 29.48,38.62 29.97,39.12 31.5,39.12 31.75,38.86 | 48.77,10.03 48.77,7.51 D3.A | 36.83,10.03 36.83,7.77 D1.A | U$7.2 68.58,38.86 68.83,39.12 70.5,39.12 70.99,38.62 C16.2 71.23,38.62 | U$5.2 50.16,38.86 | 50.16,38.86 50.42,39.12 52.07,39.12 52.57,38.62 C15.2 | U$6.2 31.75,38.86 | 71.23,38.62 71.26,38.62 | 50.16,38.86 49.91,39.12 48.26,39.12 46.1,41.27 46.1,51.05 45.59,51.56 42.16,51.56 41.53,52.2 41.02,52.2 40.26,51.44 39.37,51.44 38.73,50.8 | 71.63,35.69 71.63,38.23 71.23,38.62 | 25.39,34.92 25.4,34.91 | 38.73,50.8 38.1,51.44 v33.66,51.44 33.66,49.66 33.53,49.4 33.53,39.75 33.15,39.37 32.26,39.37 31.75,38.86 | U$16.46 U$16.45 | U$16.1 U$16.2 | v53.98,48.77 53.98,39.75 52.83,38.61 52.7,38.61 | C8.2 25.92,46.34 v23.62,48.64
  Bottom 0.406: U$29.2 25.4,34.91 C8.2 | U$28.2 73.66,35.67 C30.2 | U$24.2 62.23,35.67 C17.2 | U$23.2 55.24,35.18 55.24,35.67 C24.2 | U$15.2 43.81,35.56 43.81,35.67 C27.2 | U$30.2 36.83,34.91 C11.2
GND2  (via drill 0.3, 2 pad 3.81)
  Top 0.203: v51.82,11.56 50.42,11.56 50.16,11.3 R4.1 | R3.1 68.58,11.3 68.96,11.68 70.36,11.68 v70.61,11.94 | R11.1 31.75,11.3 31.88,11.43 v33.27,11.43
  Bottom 0.203: U8.5 50.48,12.38 51.31,11.56 v51.82,11.56 | v70.61,11.94 70.36,11.68 67.15,11.68 66.45,12.38 U9.5 | U1.5 32.32,12.38 v33.27,11.43
  other vias: 26.42,8.13
  pour Top (isolate 0.203, rank 3, no thermals): 77.98,27.69 86.36,27.69 86.36,5.71 24.38,5.71 24.38,10.79 69.22,10.79 69.6,11.18 71.12,11.18 71.75,11.81 74.93,11.81 77.98,14.86
I_SENSE_1
  Bottom 0.203: R12.1 45.09,7.6 D3.C 45.19,7.09 46.35,5.92 46.35,4.06 47.5,2.92 50.67,2.92 51.18,2.41 51.69,2.41 52.2,2.92 59.31,2.92 U$16.33
I_SENSE_2
  Bottom 0.203: D2.C 69.95,9.27 R10.1 64.76,5.09 U$16.38
I_SENSE_3
  Bottom 0.203: U$16.36 61.72,5.59 52.2,5.59 51.44,4.83 51.44,4.19 50.67,3.43 49.4,3.43 49.02,3.81 49.02,5.08 48.26,5.84 47.62,5.84 46.99,6.48 46.99,9.14 45.97,10.16 44.32,10.16 40.39,6.22 34.92,6.22 33.76,7.39 D1.C 33.11,7.89 R2.1
M1_OUT1  (via drill 0.3)
  Top 0.406: 42.55,20.38 45.09,20.38 U$3.2
  Bottom 0.203: U$15.3 45.09,32.89 44.32,32.13 43.56,32.13 43.18,32.51 43.18,34.92 42.93,35.18 42.16,35.18 41.91,34.92 41.91,25.91 42.67,25.15 43.81,25.15 44.56,25.9 C18.1
  Bottom 0.406: U$15.6 45.09,26.55 | 45.09,26.55 C18.1 | 45.09,26.55 45.33,26.55 v45.47,26.42
  pour Top (isolate 0.203, rank 2, no thermals): 41.53,33.91 45.85,33.91 45.85,31.88 49.78,31.88 49.66,16.89 41.53,16.89
M1_OUT2  (via drill 0.3)
  Top 0.406: 53.98,20.38 55.24,20.38 56.52,20.38 U$11.2
  Bottom 0.203: U$23.3 56.52,32.13 54.61,30.23 54.61,27.18 54.99,26.8 55.37,26.8 55.99,26.17 C23.1
  Bottom 0.406: U$23.6 56.52,26.55 | 56.52,26.55 C23.1 | 56.52,26.55 56.76,26.55 v56.9,26.42
  pour Top (isolate 0.203, rank 2, no thermals): 52.7,33.91 57.15,33.91 57.15,31.88 59.05,31.88 59.05,16.89 50.67,16.89 50.67,31.88 52.7,31.88
M2_OUT1  (via drill 0.3)
  Top 0.406: 60.96,20.38 62.23,20.38 63.5,20.38 U$10.2
  Bottom 0.203: U$24.3 63.5,32.26 61.59,30.35 61.59,27.18 61.98,26.8 62.36,26.8 62.98,26.17 C28.1
  Bottom 0.406: U$24.6 63.5,26.55 | 63.5,26.55 C28.1 | 63.5,26.55 63.74,26.55 v63.88,26.42
  pour Top (isolate 0.203, rank 2, no thermals): 60.07,33.91 64.26,33.91 64.26,31.88 68.2,31.88 68.2,16.89 60.07,16.89
M2_OUT2  (via drill 0.3)
  Bottom 0.203: U$28.3 74.93,32.51 73.03,30.61 73.03,27.3 73.41,26.92 73.66,26.92 74.41,26.17 C29.1
  Bottom 0.406: U$28.6 74.93,26.55 C29.1 74.42,26.02 v74.42,25.02
  pour Top (isolate 0.203, rank 2, no thermals): 71.12,33.91 77.09,33.91 77.09,16.89 69.09,16.89 69.09,31.88 71.12,31.88
M3_OUT1  (via drill 0.3)
  Top 0.406: U$20.5 U$20.4
  Bottom 0.203: U$29.3 26.67,31.62 24.77,29.72 24.77,26.42 25.15,26.04 25.4,26.04 26.02,25.41 C9.1
  Bottom 0.406: U$29.6 26.67,25.92 | 26.67,25.92 C9.1 | 26.67,25.92 26.91,25.92 v27.05,25.78
  pour Top (isolate 0.203, rank 2, no thermals): 21.21,33.91 27.43,33.91 27.43,31.88 31.24,31.88 31.24,16.89 21.21,16.89
M3_OUT2  (via drill 0.3)
  Bottom 0.203: U$30.6 U$30.3
  Bottom 0.406: U$30.6 38.1,25.79 | 38.1,25.79 C10.1 | 38.1,25.79 38.34,25.79 v38.48,25.65
  pour Top (isolate 0.203, rank 2, no thermals): 34.29,33.91 38.86,33.91 38.86,31.88 40.51,31.88 40.51,16.89 32.26,16.89 32.26,31.88 34.29,31.88
MOTOR1_GND  (via drill 0.3)
  Top 0.203: v51.44,12.45 50.55,12.45 50.16,12.83 R4.2
  Bottom 0.203: U8.4 49.6,14.29 v51.44,12.45
  pour Top (isolate 0.203, no thermals): 42.29,16.13 58.55,16.13 58.55,12.06 55.63,12.06 54.36,13.34 49.78,13.34 48.01,11.56 42.29,11.56
MOTOR2_GND  (via drill 0.3)
  Top 0.203: v69.72,12.45 68.83,12.45 68.58,12.7 R3.2
  Bottom 0.203: U9.4 67.88,14.29 v69.72,12.45
  pour Top (isolate 0.203, no thermals): 60.71,16.13 76.96,16.13 76.96,12.32 71.63,12.32 70.61,13.34 68.2,13.34 66.42,11.56 60.71,11.56
MOTOR3_GND  (via drill 0.3)
  Top 0.203: R11.2 31.75,12.83 32.13,12.45 v33.27,12.45
  Bottom 0.203: U1.4 31.43,14.29 v33.27,12.45
  pour Top (isolate 0.203, no thermals): 23.88,16.13 40.13,16.13 40.13,11.43 37.85,11.43 35.94,13.34 31.37,13.34 29.59,11.56 23.88,11.56
N$1
  Top 0.203: SV1.5 10.79,5.71 7.11,5.71 R27.1
  Bottom 0.203: SV1.5 11.94,4.57 11.94,8.89 12.57,9.53 13.34,9.53 IC1.3
N$2  (via drill 0.3)
  Top 0.203: R28.1 7.11,3.81 8.64,3.81 9.02,3.43 13.59,3.43 SV1.3 15.88,5.71 v15.88,9.02
  Bottom 0.203: IC1.2 13.46,10.79 14.73,10.79 15.88,9.65 v15.88,9.02
N$3  (via drill 0.3)
  Top 0.203: R30.1 7.11,1.91 8,1.91 9.02,2.92 15.62,2.92 SV1.1 18.8,6.1 v18.8,6.6
  Bottom 0.203: IC1.1 13.46,12.06 14.86,12.06 17.78,9.14 17.78,7.62 v18.8,6.6
N$4
  Bottom 0.203: IC1.7 9.02,10.79 11.3,8.51 11.3,6.22 SV1.7 8.26,5.71 R26.1
N$5
  Bottom 0.203: R1.1 R5.2
N$6
  Bottom 0.203: U1.1 26.98,12.38 29.98,9.39 R2.2
N$8
  Bottom 0.203: R10.2 61.34,9.27 59.56,11.05 59.56,11.94 59.94,12.32 60.58,12.32 60.96,11.94 62.48,11.94 62.93,12.38 U9.1
N$9
  Bottom 0.203: U8.1 45.05,10.94 R12.2
N$10  (via drill 0.3)
  Top 0.203: 46.35,33.66 U$2.7 | U$2.1 42.17,30.98
  Top 0.406: 42.17,30.98 41.78,31.37 41.4,31.37 41.02,31.75 41.02,34.16 41.4,34.54 45.47,34.54 46.35,33.66 | 46.35,33.66 U$2.7 | 46.35,33.66 47.12,33.66 v47.37,33.91
  Bottom 0.406: U$15.7 43.81,30.1 45.21,31.5 46.61,31.5 47.37,32.26 v47.37,33.91
N$11  (via drill 0.3)
  Top 0.203: U$3.1
  Top 0.406: v47.37,16 46.35,16 U$3.7 | U$3.1 42.17,13.46 v41.27,14.35
  Bottom 0.406: U$15.5 46.35,27.56 46.86,27.05 46.86,16.51 | 46.86,16.51 v47.37,16 | v41.27,14.35 43.43,16.51 46.86,16.51
N$13  (via drill 0.3)
  Top 0.203: LED1.C 49.52,20.82 50.16,21.46 v50.16,21.72
  Bottom 0.203: R13.2 49.26,20.82 v50.16,21.72
N$14  (via drill 0.3)
  Top 0.203: LED2.C 50.81,19.32 50.16,18.67 v50.16,18.41
  Bottom 0.203: R14.2 51.04,19.29 v50.16,18.41
N$15
  Top 0.203: LED3.C 7.74,52.07 R8.2
N$16
  Bottom 0.406: U$15.8 42.55,26.55 C18.2
N$17  (via drill 0.3)
  Top 0.406: U$20.7 27.94,33.66 | 27.94,33.66 v28.96,33.66 | U$20.1 23.75,31.11 22.73,32.13 22.73,34.29 22.99,34.54 27.56,34.54 27.94,34.16 27.94,33.66
  Bottom 0.406: v28.96,33.66 28.96,31.88 27.69,30.61 26.54,30.61 25.4,29.46 U$29.7
N$18
  Bottom 0.406: U$24.8 60.96,26.55 C28.2
N$19  (via drill 0.3)
  Top 0.406: v28.96,16 27.94,16 U$21.7 | U$21.1 23.75,13.33 v22.86,14.22
  Bottom 0.406: v22.86,14.22 24.64,16 27.94,16 28.32,16 | 28.32,16 v28.96,16 | U$29.5 27.94,26.8 28.32,26.42 28.32,16
N$20
  Bottom 0.406: U$23.8 53.98,26.55 C23.2
N$21  (via drill 0.3)
  Top 0.203: U$4.1 53.6,30.98
  Top 0.406: v58.8,33.4 58.51,33.11 U$4.7 57.78,33.66 57.02,34.42 52.83,34.42 52.58,34.16 52.58,32 53.6,30.98
  Bottom 0.406: U$23.7 55.24,29.84 56.52,31.11 57.4,31.11 58.8,32.51 v58.8,33.4
N$22
  Bottom 0.406: U$29.8 24.13,25.67 C9.2
N$23  (via drill 0.3)
  Top 0.203: 57.78,15.88 U$11.7
  Top 0.406: v58.8,15.88 57.78,15.88 | U$11.1 53.6,12.95 v54.61,11.94
  Bottom 0.406: U$23.5 57.78,27.69 58.29,27.18 58.29,16.38 v58.8,15.88 58.55,15.88 v54.61,11.94
N$24
  Bottom 0.406: U$28.8 72.39,26.55 C29.2
N$25  (via drill 0.3)
  Top 0.406: U$12.1 72.02,30.98 70.99,32 70.99,34.16 71.25,34.42 75.44,34.42 76.2,33.66 U$12.7 76.2,32.64 76.58,32.26 v77.22,32.26
  Bottom 0.406: U$28.7 73.66,30.23 74.55,31.11 76.07,31.11 v77.22,32.26
N$26  (via drill 0.3)
  Top 0.203: 76.26,15.24 76.26,15.27
  Top 0.406: v77.22,15.24 76.26,15.24 | 76.26,15.27 U$13.7 | U$13.1 72.75,12.98 v73.15,12.57
  Bottom 0.406: v73.15,12.57 74.55,12.57 v77.22,15.24 77.22,20.32 76.2,21.34 U$28.5
N$27
  Bottom 0.406: U$30.8 35.56,25.79 C10.2
N$28  (via drill 0.3)
  Top 0.406: 64.77,33.66 v65.79,33.66 | 64.77,33.66 U$9.7 | U$9.1 60.55,30.89 59.56,31.88 59.56,34.16 59.82,34.42 64.01,34.42 64.77,33.66
  Bottom 0.406: U$24.7 62.23,29.84 63.88,31.5 64.9,31.5 65.79,32.38 v65.79,33.66
N$29  (via drill 0.3)
  Top 0.406: v65.79,16 64.77,16 U$10.7 | U$10.1 60.59,11.82 v60.33,11.56
  Bottom 0.406: v60.33,11.56 60.45,11.43 64.52,11.43 65.02,11.94 65.02,15.24 v65.79,16 63.63,18.16 63.63,24.26 65.15,25.78 65.15,27.18 64.77,27.56 U$24.5
N$30  (via drill 0.3)
  Top 0.406: U$22.7 39.37,34.16 38.99,34.54 34.42,34.54 34.16,34.29 34.16,32.13 35.19,31.11 U$22.1 35.19,30.22 v35.94,29.46
  Bottom 0.406: U$30.7 36.83,28.57 v35.94,29.46
N$31  (via drill 0.3)
  Top 0.406: v40.26,15.75 39.37,15.75 U$19.7 | U$19.1 35.19,12.82 v36.2,11.81
  Bottom 0.203: v36.2,11.81 36.32,11.81
  Bottom 0.406: 36.32,11.81 v40.26,15.75 40.26,25.91 39.37,26.8 U$30.5
N$32
  Top 0.203: U2.10 16.12,11.79 C4.1
N$33
  Top 0.203: U2.20 16.62,18.64 C12.1
N$34  (via drill 0.3)
  Top 0.203: LED4.C 68.58,21.46 v68.58,21.84
  Bottom 0.203: R15.2 67.83,20.84 68.58,21.59 v68.58,21.84
N$35  (via drill 0.3)
  Top 0.203: LED5.C 69.34,19.3 68.58,18.54 v68.58,18.29
  Bottom 0.203: R16.2 67.83,19.16 68.58,18.41 v68.58,18.29
N$36  (via drill 0.3)
  Top 0.203: LED6.C 31.75,21.59 v31.75,21.72
  Bottom 0.203: v31.75,21.72 32.5,20.97 R17.2
N$37  (via drill 0.3)
  Top 0.203: LED7.C 32.51,19.3 31.75,18.54 v31.75,18.41
  Bottom 0.203: v31.75,18.41 31.75,18.54 32.5,19.29 R19.2
N$38
  Top 0.203: R20.2 10.28,46.85 11.18,47.75 R22.1
N$39
  Top 0.203: R20.1 10.15,45.34 R21.2 11.68,43.81 12.64,42.85 U$14.7
N$41
  Bottom 0.203: U$23.1 53.98,32.89 53.09,32 53.09,30.05 52.86,29.82 52.86,26.01 53.21,25.65 53.21,24.64 52.93,24.35 51.24,24.35 U$25.4
N$42
  Bottom 0.203: U$15.1 42.55,31.37 43.18,30.73 43.18,27.18 43.43,26.92 44.2,26.92 44.45,27.18 44.45,29.84 45.09,30.48 47.12,30.48 48.26,29.34 50.42,29.34 50.93,28.83 50.93,28.32 50.42,27.81 48.77,27.81 48.51,27.56 48.51,25.15 49.22,24.45 U$25.6
N$43
  Bottom 0.203: U$27.6 33.16,24.24 33.78,23.62 33.78,18.16 32.77,17.14 30.23,17.14 29.08,18.29 29.08,26.42 28.7,26.8 28.7,28.96 28.45,29.21 27.56,29.21 27.3,28.96 27.3,26.54 27.81,26.04 27.81,25.53 26.67,24.38 24,24.38 23.37,25.02 23.37,31.37 24.13,32.13 U$29.1
N$44
  Bottom 0.203: U$27.4 32.62,26.68 30.99,28.32 30.99,28.83 31.5,29.34 32,29.34 32.51,28.83 33.53,28.83 35.56,30.86 U$30.1
N$45
  Bottom 0.203: U$24.1 60.96,32.89 60.2,32.13 60.2,26.04 61.09,25.15 63.63,25.15 64.64,26.16 64.64,26.67 64.14,27.18 64.14,29.72 64.52,30.1 65.15,30.1 65.79,29.46 65.79,28.19 66.61,27.37 U$26.6
N$46
  Bottom 0.203: U$26.4 67.68,25.77 67.94,26.04 67.94,27.94 66.17,29.72 66.17,31.11 66.67,31.62 67.94,31.62 68.2,31.88 68.83,31.88 69.22,31.5 70.87,31.5 72.39,33.02 U$28.1
PWM0A  (via drill 0.3)
  Top 0.203: U$16.22 44.07,3.43 24.26,3.43 23.75,3.94 23.24,3.94 22.73,3.43 21.46,3.43 20.95,3.94 20.95,5.97 v18.8,8.13 | v36.2,48.9 24.38,48.9 23.5,49.78 23.5,50.55 22.86,51.18 20.95,51.18 20.57,51.56 18.54,51.56 17.27,50.29 v17.27,48.9
  Bottom 0.203: U$27.3 30.29,26.73 29.72,27.3 29.72,29.46 29.34,29.84 29.34,30.86 29.97,31.5 33.27,31.5 34.16,32.38 34.16,46.86 v36.2,48.9 | v17.27,48.9 21.34,44.83 21.34,20.32 20.83,19.81 19.18,19.81 18.8,19.43 v18.8,8.13
PWM1A  (via drill 0.3)
  Top 0.203: v51.44,3.17 51.18,2.92 46.48,2.92 v46.35,3.05
  Bottom 0.203: U$16.14 36.07,5.59 43.18,5.59 43.81,4.95 43.81,3.68 44.32,3.17 46.23,3.17 v46.35,3.05 | U$26.3 69.91,25.47 71.88,23.5 71.88,8.51 69.09,5.71 67.56,5.71 66.67,4.83 66.67,3.81 66.04,3.17 65.02,3.17 64.39,2.54 63.88,2.54 63.25,3.17 59.94,3.17 59.69,3.43 51.69,3.43 v51.44,3.17
PWM2A
  Bottom 0.203: U$1.19 42.55,42.55 47.12,37.97 47.12,35.18 48.13,34.16 48.13,33.71 47.88,33.45 47.88,32.38 48.26,32 49.78,32 50.42,31.37 50.42,29.97 51.44,28.96 51.44,27.43 51.12,27.11 U$25.3
QE0A
  Bottom 0.203: U$16.42 71.5,3.43 73.79,3.43 74.3,3.94 74.3,4.95 78.74,9.4 78.74,40.26 77.72,41.27 77.85,49.66 76.07,51.44 75.31,51.44 74.3,52.45 74.3,53.21 73.79,53.72 49.4,53.72 48.9,53.21 48.9,49.28 49.22,48.96 U$5.4
QE0B  (via drill 0.3)
  Top 0.203: U$16.27 53.47,1.91 54.48,2.92 63.5,2.92 63.88,2.54 64.39,2.54 65.02,3.17 68.71,3.17 68.96,3.43 76.71,3.43 v76.83,3.3 | v78.87,49.02 72.64,49.02 71.75,49.91 71.75,50.93 71.25,51.44 59.18,51.44 58.93,51.69 57.28,51.69 56.77,52.2 56.26,52.2 55.75,51.69 53.72,51.69 53.47,51.44 v51.44,51.44
  Bottom 0.203: v76.83,3.3 77.72,4.19 77.72,6.86 79.25,8.38 79.25,48.77 v78.87,49.02 | U$5.6 51.12,48.58 51.44,48.9 v51.44,51.44
QE1A
  Bottom 0.203: U$1.35 61.85,51.18 59.56,51.18 59.05,50.67 59.05,49.66 67.63,41.08 U$7.4
QE1B
  Bottom 0.203: U$7.6 69.53,41.85 63.37,48.01 62.48,48.01 U$1.33
QE2A
  Bottom 0.203: U$6.4 30.8,48.96 31.11,49.28 31.11,51.44 U$1.12
QE2B
  Bottom 0.203: U$6.6 32.7,49.85 U$1.11
QEIA1
  Bottom 0.203: U$5.3 49.22,35.88 MOTOR_1.6
QEIA2
  Bottom 0.203: U$7.3 67.63,35.88 MOTOR_2.6
QEIA3
  Bottom 0.203: U$6.3 30.8,35.88 MOTOR_3.6
QEIB1
  Bottom 0.203: U$5.1 51.12,35.88 MOTOR_1.5
QEIB2
  Bottom 0.203: U$7.1 69.53,35.88 MOTOR_2.5
QEIB3
  Bottom 0.203: U$6.1 32.7,35.88 MOTOR_3.5
SCL  (via drill 0.3)
  Top 0.203: U2.23 15.12,17.77 14.86,18.03 12.06,18.03 9.91,16 | U3.14 2.54,13.34 2.03,13.84 2.03,14.86 3.17,16 9.91,16 | U$16.19 41.53,0.89 23.88,0.89 23.5,1.27 23.5,2.16 22.73,2.92 21.08,2.92 20.83,3.17 v18.29,3.17 | v13.34,5.84 11.68,5.84 10.54,6.99 v10.54,7.87 10.54,11.68 9.65,12.57 9.65,14.1 9.91,14.35 9.91,16
  Bottom 0.203: 13.34,2.92 9.02,2.92 8,1.91 7.11,1.91 R7.1 | 13.34,2.92 v13.34,5.84 | IC1.6 9.02,9.53 10.54,8 v10.54,7.87 | 13.34,2.92 18.03,2.92 v18.29,3.17
SDA  (via drill 0.3)
  Top 0.203: U3.13 3.08,15.14 3.43,15.49 8.51,15.49 v9.14,14.86 9.14,12.19 9.91,11.43 9.91,9.14 9.53,8.76 8.64,8.76 8.13,8.26 v8.13,7.24 | U2.24 13.05,17.24 v11.56,15.75
  Bottom 0.203: U$16.20 41.27,3.17 41.27,1.4 40.77,0.89 6.73,0.89 6.35,1.27 6.35,3.81 | 6.35,3.81 6.35,7.24 7.37,8.26 8.13,8.26 | 8.13,8.26 IC1.5 8.13,8.26 | R18.1 6.35,3.81 | v8.13,7.24 8.13,8.26 | v11.56,15.75 10.03,15.75 v9.14,14.86
V_SENSE  (via drill 0.3)
  Top 0.203: R6.2 77.86,2.68 v77.85,2.67 77.72,2.54 76.58,2.54 76.2,2.92 69.47,2.92 68.45,1.91 U$16.39
  Bottom 0.203: R5.1 80.52,11.96 D4.C 80.79,5.61 v77.85,2.67
VCC  (via drill 0.3)
  Top 0.203: v74.3,51.44 74.3,53.21 73.79,53.72 49.4,53.72 48.9,53.21 | 41.27,53.09 41.91,53.72 48.39,53.72 48.9,53.21 | 41.27,53.09 v41.27,51.44 | 48.9,53.21 48.9,49.66 49.66,48.9 53.09,48.9 53.98,49.78 53.98,50.8 54.36,51.18 56.26,51.18 v56.52,51.44 | v26.04,51.44 26.04,53.21 | 26.04,53.21 26.54,53.72 40.64,53.72 41.27,53.09 | v15.24,53.09 18.54,53.09 19.18,53.72 25.53,53.72 26.04,53.21 | U$14.1 13.29,47.72 R22.2 13.32,48.91 12.75,49.48 C22.1 14.1,49.91 v15.24,51.05
  Bottom 0.203: C27.1 45.84,38.11 41.27,42.67 | C11.1 38.85,40.25 41.27,42.67 | C8.1 27.42,47.64 26.04,49.02 v26.04,51.44 | 41.27,42.67 41.27,48.9 v41.27,51.44 | C24.1 57.27,38.47 58.93,40.13 | C17.1 64.25,36.46 60.58,40.13 58.93,40.13 | C30.1 75.68,48.15 74.3,49.53 v74.3,51.44 | v56.52,51.44 56.52,49.91 57.53,48.9 57.78,48.9 60.2,46.48 SJ1.2 60.2,43.18 58.93,41.91 58.93,40.13 | v15.24,51.05 v15.24,53.09
  Bottom 0.406: U$29.4 27.94,34.91 C8.1 | U$30.4 39.37,34.91 C11.1 | U$15.4 46.35,35.67 C27.1 | U$23.4 57.78,35.67 C24.1 | U$24.4 64.77,35.67 C17.1 | U$28.4 76.2,35.67 C30.1

### Text on the board
_tsilk: Power | MotorCape / Kevin Martin / Rev 3 | V+ | cc | LP2951-N | Motor3 | Motor1 | Motor2 | V+ | GND | 2.2nF | ITG-3200 | ADXL345 | R | R | R | GND | 5.6k | 1k | 0.1u | 10u | 0 | WP | A2 | A1 | A0
_bsilk: 0.1u | VDRV | V+ | 5.6k | 5V | VBAT | 1k | SN74LVC2G17 | SN74LVC2G17 | SN74LVC2G17 | TPS2837 | TPS2837 | TPS2837 | TPS2837 | TPS2837 | V+ | TPS2837 | 74LVC1G19 | 74LVC1G19 | 74LVC1G19 | GND | 24LC256 | INA196 | INA196 | INA196 | GND | 1V8 | 1V8 | 1V8 | 1V8